# Altium schematic sheet 01)CPU-1.SchDoc
size 297 x 209 mm
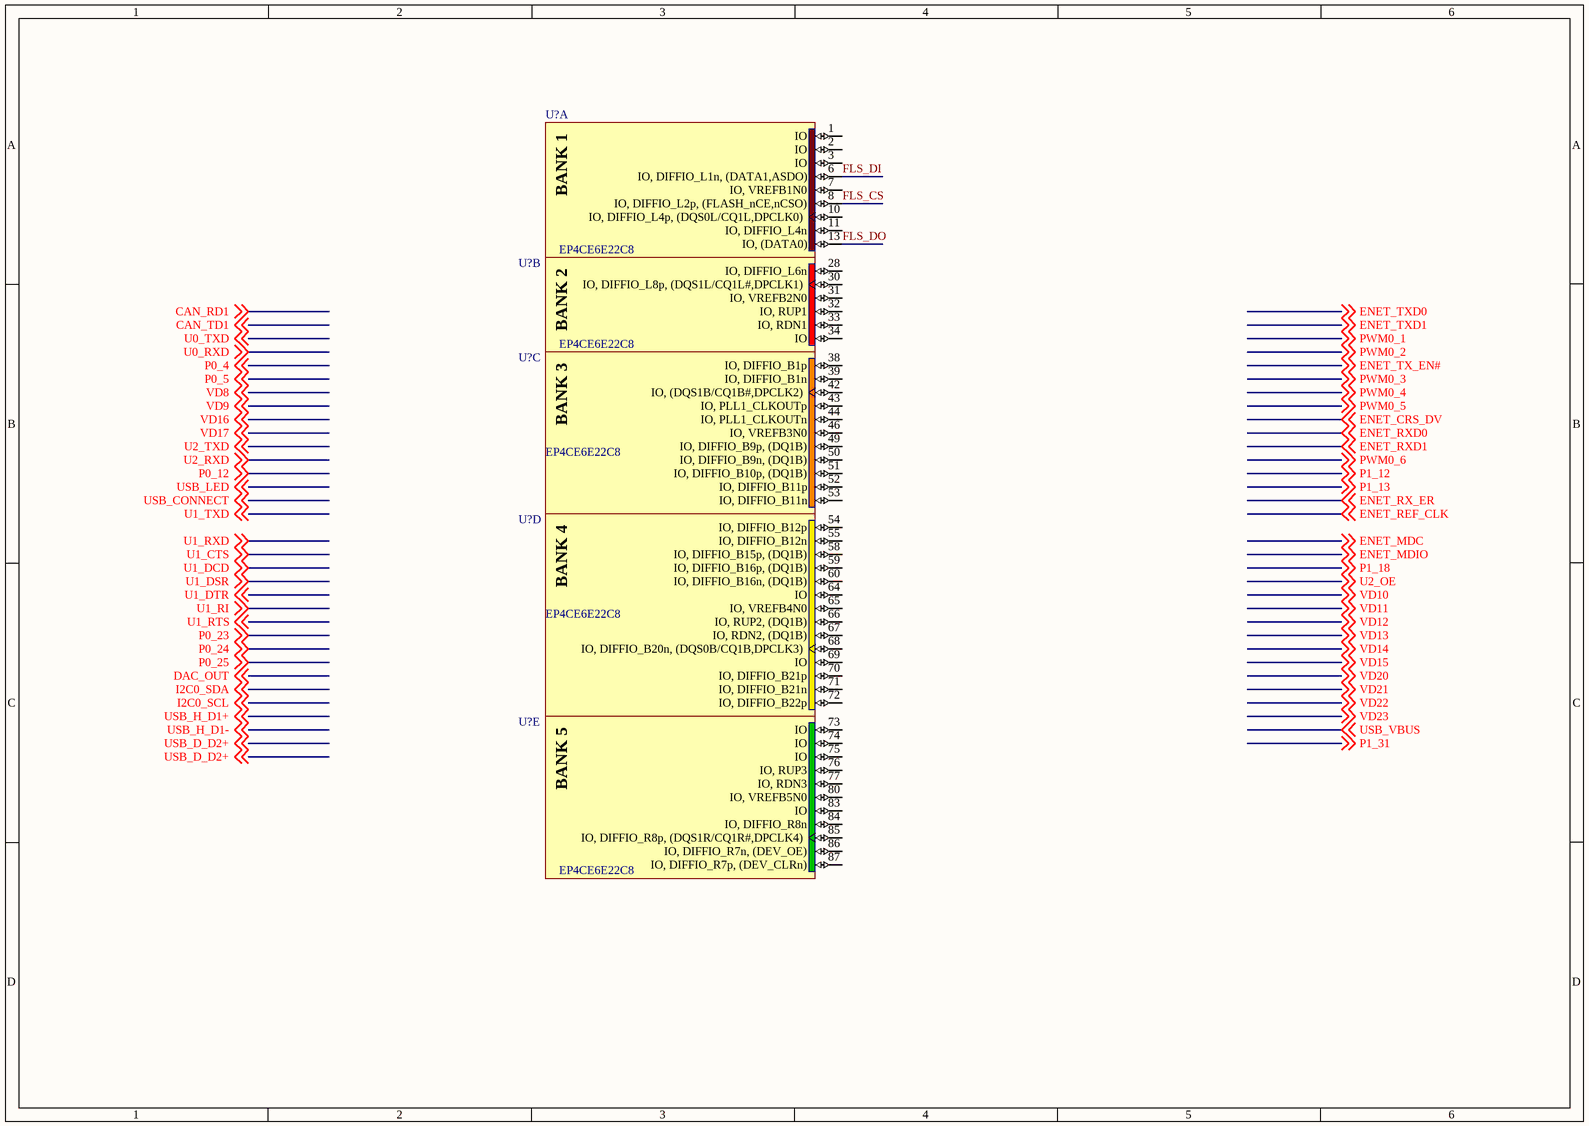
[diagram p0: 01)CPU-1.SchDoc]

## Parts
(Parts that share a designator on the sheet are numbered #1, #2 ... from top to bottom, then left to right.)
U?#1  EP4CE6E22C8  [EQFP144_N]  (part A of 13)
U?#2  EP4CE6E22C8  [EQFP144_N]  (part B of 13)
U?#3  EP4CE6E22C8  [EQFP144_N]  (part C of 13)
U?#4  EP4CE6E22C8  [EQFP144_N]  (part D of 13)
U?#5  EP4CE6E22C8  [EQFP144_N]  (part E of 13)

## Nets
FLS_CS: U?#1.8(IO,_DIFFIO_L2p,_(FLASH_nCE,nCSO))
FLS_DI: U?#1.6(IO,_DIFFIO_L1n,_(DATA1,ASDO))
FLS_DO: U?#1.13(IO,_(DATA0))

Not connected (* = marked no-connect by the designer): U?#1 1(IO) 2(IO) 3(IO) 7(IO,_VREFB1N0) 10(IO,_DIFFIO_L4p,_(DQS0L/CQ1L,DPCLK0)) 11(IO,_DIFFIO_L4n); U?#2 28(IO,_DIFFIO_L6n) 30(IO,_DIFFIO_L8p,_(DQS1L/CQ1L#,DPCLK1)) 31(IO,_VREFB2N0) 32(IO,_RUP1) 33(IO,_RDN1) 34(IO); U?#3 38(IO,_DIFFIO_B1p) 39(IO,_DIFFIO_B1n) 42(IO,_(DQS1B/CQ1B#,DPCLK2)) 43(IO,_PLL1_CLKOUTp) 44(IO,_PLL1_CLKOUTn) 46(IO,_VREFB3N0) 49(IO,_DIFFIO_B9p,_(DQ1B)) 50(IO,_DIFFIO_B9n,_(DQ1B)) 51(IO,_DIFFIO_B10p,_(DQ1B)) 52(IO,_DIFFIO_B11p) 53(IO,_DIFFIO_B11n); U?#4 54(IO,_DIFFIO_B12p) 55(IO,_DIFFIO_B12n) 58(IO,_DIFFIO_B15p,_(DQ1B)) 59(IO,_DIFFIO_B16p,_(DQ1B)) 60(IO,_DIFFIO_B16n,_(DQ1B)) 64(IO) 65(IO,_VREFB4N0) 66(IO,_RUP2,_(DQ1B)) 67(IO,_RDN2,_(DQ1B)) 68(IO,_DIFFIO_B20n,_(DQS0B/CQ1B,DPCLK3)) 69(IO) 70(IO,_DIFFIO_B21p) 71(IO,_DIFFIO_B21n) 72(IO,_DIFFIO_B22p); U?#5 73(IO) 74(IO) 75(IO) 76(IO,_RUP3) 77(IO,_RDN3) 80(IO,_VREFB5N0) 83(IO) 84(IO,_DIFFIO_R8n) 85(IO,_DIFFIO_R8p,_(DQS1R/CQ1R#,DPCLK4)) 86(IO,_DIFFIO_R7n,_(DEV_OE)) 87(IO,_DIFFIO_R7p,_(DEV_CLRn))

## Notes on the sheet
- (in symbol EP4CE6E22C8, part A) BANK 1
- (in symbol EP4CE6E22C8, part B) BANK 2
- (in symbol EP4CE6E22C8, part C) BANK 3
- (in symbol EP4CE6E22C8, part D) BANK 4
- (in symbol EP4CE6E22C8, part E) BANK 5

## Library data of the parts
U?#1-U?#5 = EP4CE6E22C8: Cyclone IV Family FPGA, 2V Core, 91 I/O Pins, 2 PLLs, 144-Pin QFP, Speed Grade 8, Commercial Grade; Published: 3-May-2010; DatasheetVersion: ver1.2, Mar-2010; PackageVersion: ver16.0, Dec-2009; PackageReference: EQFP144; Publisher: Altium Limited; PackageDescription: 144-Pin Plastic Enhanced Quad Flat Pack (EQFP144) - Wire Bond; Code_JEDEC: MS-026-BFB; ComponentLink1Description: Manufacturer Link; ComponentLink1URL: http://www.altera.com/; ComponentLink2Description: Handbook; ComponentLink2URL: http://www.altera.com/literature/hb/cyclone-iv/cyclone4-handbook.pdf; ComponentLink3Description: Pinout Specification; ComponentLink3URL: http://www.altera.com/literature/lit-dp.jsp?category=cyc%204&showspreadsheet=y; ComponentLink4Description: Packaging Specification; ComponentLink4URL: http://www.altera.com/literature/ds/dspkg.pdf